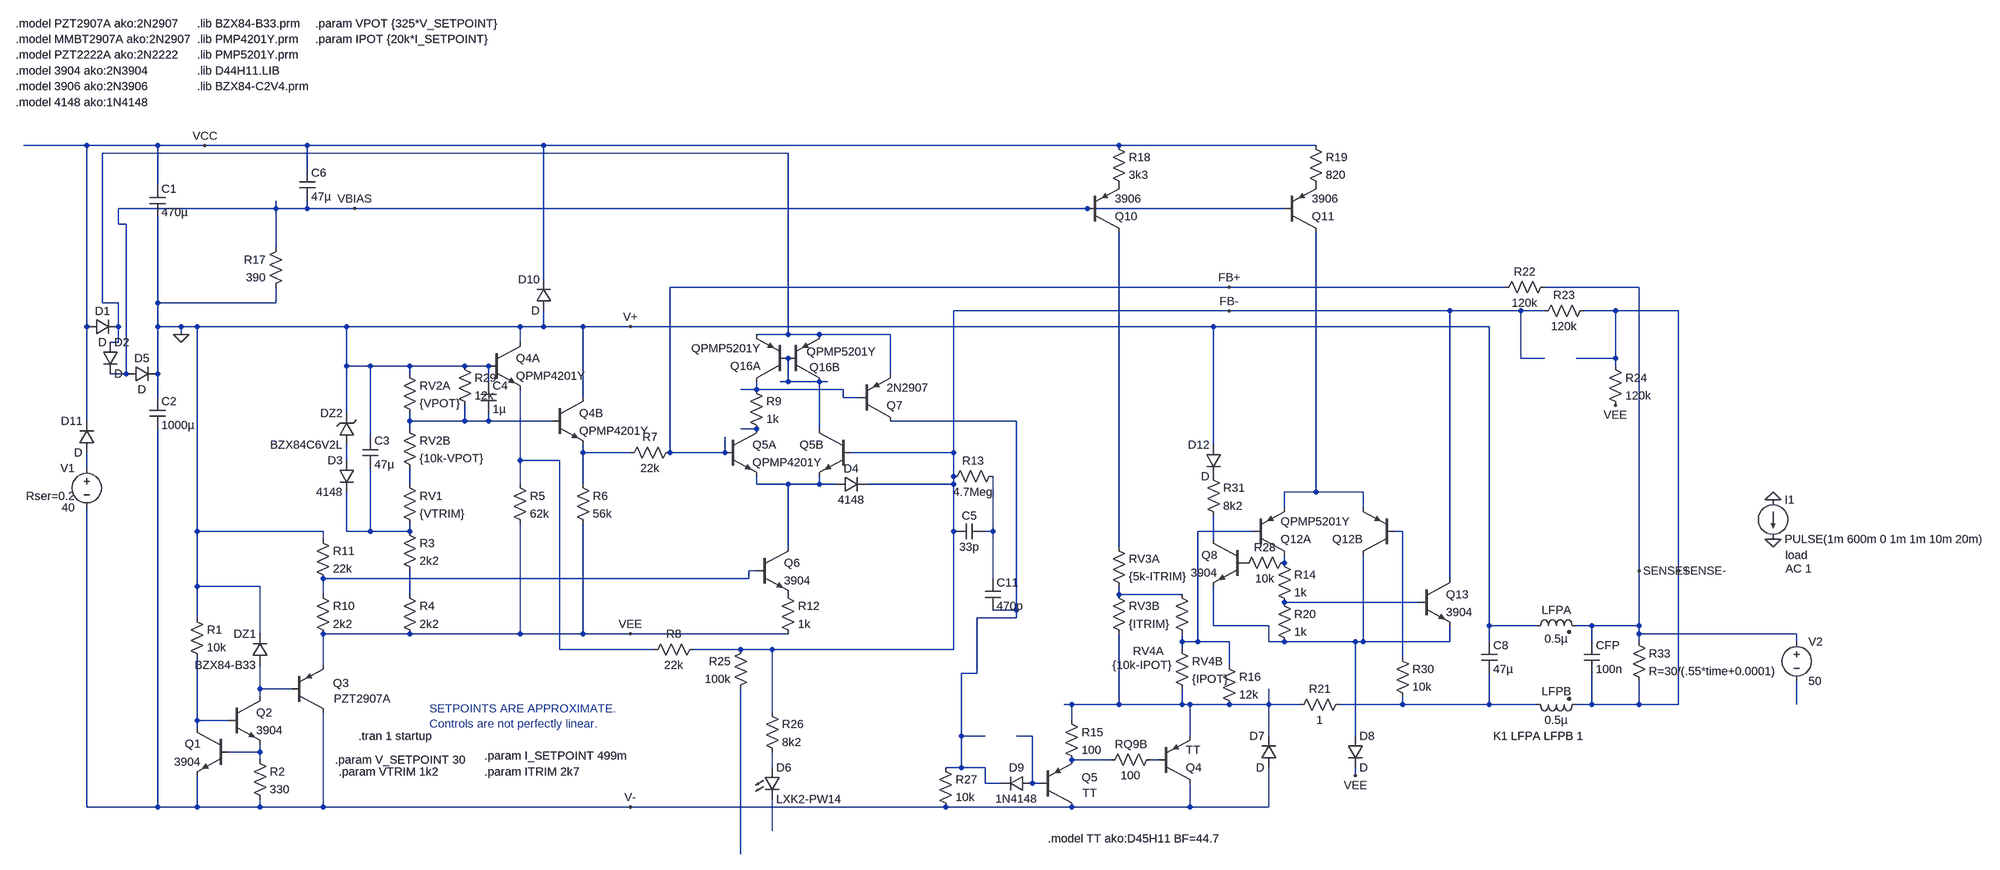
[diagram p0: schematic stability.asc]
stability.asc, the LTspice schematic file:
Version 4
SHEET 1 3448 888
WIRE -464 -800 -592 -800
WIRE -320 -800 -464 -800
WIRE -224 -800 -320 -800
WIRE -16 -800 -224 -800
WIRE 464 -800 -16 -800
WIRE 1632 -800 464 -800
WIRE 2032 -800 1632 -800
WIRE 960 -784 -432 -784
WIRE -16 -752 -16 -800
WIRE -320 -720 -320 -800
WIRE -80 -672 -80 -688
WIRE -80 -672 -400 -672
WIRE -16 -672 -16 -688
WIRE -16 -672 -80 -672
WIRE 80 -672 -16 -672
WIRE 1568 -672 80 -672
WIRE 1968 -672 1568 -672
WIRE -400 -640 -400 -672
WIRE -384 -640 -400 -640
WIRE -80 -592 -80 -672
WIRE 464 -528 464 -800
WIRE 1856 -512 720 -512
WIRE 2416 -512 1856 -512
WIRE 2688 -512 2496 -512
WIRE -432 -480 -432 -784
WIRE -400 -480 -432 -480
WIRE -320 -480 -320 -656
WIRE -80 -480 -80 -512
WIRE -80 -480 -320 -480
WIRE 1856 -464 1296 -464
WIRE 2304 -464 1856 -464
WIRE 2448 -464 2304 -464
WIRE 2496 -464 2448 -464
WIRE 2640 -464 2576 -464
WIRE 2768 -464 2640 -464
WIRE -464 -432 -464 -800
WIRE -400 -432 -400 -480
WIRE -320 -432 -320 -480
WIRE -272 -432 -320 -432
WIRE -240 -432 -272 -432
WIRE 64 -432 -240 -432
WIRE 416 -432 64 -432
WIRE 464 -432 464 -464
WIRE 464 -432 416 -432
WIRE 544 -432 464 -432
WIRE 640 -432 544 -432
WIRE 1824 -432 640 -432
WIRE 2384 -432 1824 -432
WIRE -272 -416 -272 -432
WIRE 960 -416 960 -784
WIRE 960 -416 896 -416
WIRE 1024 -416 960 -416
WIRE 1168 -416 1024 -416
WIRE -400 -400 -400 -432
WIRE -400 -400 -416 -400
WIRE 416 -400 416 -432
WIRE 2448 -368 2448 -464
WIRE 2496 -368 2448 -368
WIRE 2640 -368 2640 -464
WIRE 2640 -368 2560 -368
WIRE 64 -352 64 -432
WIRE 112 -352 64 -352
WIRE 192 -352 112 -352
WIRE 304 -352 192 -352
WIRE 352 -352 304 -352
WIRE 2640 -352 2640 -368
WIRE -384 -336 -384 -640
WIRE -384 -336 -416 -336
WIRE -320 -336 -320 -432
WIRE 192 -336 192 -352
WIRE 1168 -336 1168 -416
WIRE 352 -320 352 -352
WIRE 960 -320 960 -368
WIRE 960 -320 944 -320
WIRE 1024 -320 960 -320
WIRE 1040 -320 1024 -320
WIRE 896 -304 896 -320
WIRE 896 -304 864 -304
WIRE 1072 -304 896 -304
WIRE -320 -288 -320 -336
WIRE 544 -288 544 -432
WIRE 1072 -288 1072 -304
WIRE 1104 -288 1072 -288
WIRE 64 -256 64 -352
WIRE -464 -240 -464 -432
WIRE 192 -240 192 -256
WIRE 304 -240 304 -272
WIRE 304 -240 192 -240
WIRE 352 -240 352 -256
WIRE 352 -240 304 -240
WIRE 480 -240 352 -240
WIRE 1424 -240 1168 -240
WIRE 192 -224 192 -240
WIRE 896 -224 864 -224
WIRE 1024 -224 1024 -320
WIRE 112 -208 112 -352
WIRE 1824 -192 1824 -432
WIRE 544 -176 544 -192
WIRE 640 -176 544 -176
WIRE 720 -176 720 -512
WIRE 832 -176 832 -208
WIRE 832 -176 720 -176
WIRE 1296 -176 1296 -464
WIRE 1296 -176 1088 -176
WIRE 64 -160 64 -192
WIRE 416 -160 416 -304
WIRE 496 -160 416 -160
WIRE -464 -144 -464 -176
WIRE 1296 -128 1296 -176
WIRE 192 -112 192 -144
WIRE 416 -112 416 -160
WIRE 544 -112 544 -176
WIRE 896 -112 896 -128
WIRE 960 -112 896 -112
WIRE 1024 -112 1024 -128
WIRE 1024 -112 960 -112
WIRE 1056 -112 1024 -112
WIRE 1296 -112 1296 -128
WIRE 1296 -112 1120 -112
WIRE 2032 -96 2032 -624
WIRE 2032 -96 1968 -96
WIRE 2128 -96 2032 -96
WIRE 1968 -64 1968 -96
WIRE 2128 -64 2128 -96
WIRE -240 -16 -240 -432
WIRE 16 -16 -240 -16
WIRE 64 -16 64 -96
WIRE 112 -16 112 -144
WIRE 112 -16 64 -16
WIRE 192 -16 192 -32
WIRE 192 -16 112 -16
WIRE 1296 -16 1296 -112
WIRE 1376 -16 1376 -128
WIRE 1376 -16 1360 -16
WIRE 1904 -16 1792 -16
WIRE 2208 -16 2192 -16
WIRE 16 0 16 -16
WIRE 1824 0 1824 -48
WIRE 960 16 960 -112
WIRE 1632 16 1632 -624
WIRE 1968 48 1968 32
WIRE 896 64 880 64
WIRE 2688 64 2688 -512
WIRE 2768 64 2768 -464
WIRE 880 80 880 64
WIRE 880 80 16 80
WIRE 1376 80 1376 -16
WIRE 2304 80 2304 -464
WIRE -240 96 -240 -16
WIRE -112 96 -240 96
WIRE 16 112 16 80
WIRE 192 112 192 64
WIRE 1632 112 1632 96
WIRE 1760 112 1632 112
WIRE 2240 128 1968 128
WIRE 1424 144 1424 -240
WIRE 1424 144 1376 144
WIRE -240 160 -240 96
WIRE 1424 160 1424 144
WIRE 1424 160 1344 160
WIRE 1824 176 1824 96
WIRE 1936 176 1824 176
WIRE 2384 176 2384 -432
WIRE 2480 176 2384 176
WIRE 2592 176 2560 176
WIRE 2688 176 2688 64
WIRE 2688 176 2592 176
WIRE -112 192 -112 96
WIRE 192 192 16 192
WIRE 416 192 416 -32
WIRE 416 192 192 192
WIRE 544 192 544 -32
WIRE 544 192 416 192
WIRE 640 192 544 192
WIRE 960 192 640 192
WIRE 2688 192 2688 176
WIRE 3008 192 2688 192
WIRE 1760 208 1760 192
WIRE 1792 208 1792 -16
WIRE 1792 208 1760 208
WIRE 1856 208 1792 208
WIRE 1936 208 1936 176
WIRE 1968 208 1936 208
WIRE 2112 208 1968 208
WIRE 2128 208 2128 32
WIRE 2128 208 2112 208
WIRE 2304 208 2304 176
WIRE 2304 208 2128 208
WIRE 2384 208 2384 176
WIRE 2592 208 2592 176
WIRE 2688 208 2688 192
WIRE 3008 208 3008 192
WIRE 496 224 496 -160
WIRE 688 224 496 224
WIRE 864 224 768 224
WIRE 928 224 864 224
WIRE 1296 224 1296 -16
WIRE 1296 224 928 224
WIRE 1760 224 1760 208
WIRE 2208 240 2208 -16
WIRE 16 256 16 192
WIRE 1856 256 1856 208
WIRE 1344 272 1344 160
WIRE 1344 272 1312 272
WIRE -112 304 -112 256
WIRE -48 304 -112 304
WIRE -112 320 -112 304
WIRE 1536 336 1520 336
WIRE 1632 336 1632 192
WIRE 1632 336 1536 336
WIRE 1760 336 1760 304
WIRE 1760 336 1632 336
WIRE 1776 336 1760 336
WIRE 1856 336 1776 336
WIRE 1936 336 1936 304
WIRE 1936 336 1856 336
WIRE 2000 336 1936 336
WIRE 2208 336 2208 320
WIRE 2208 336 2080 336
WIRE 2384 336 2384 272
WIRE 2384 336 2208 336
WIRE 2480 336 2384 336
WIRE 2592 336 2592 272
WIRE 2592 336 2560 336
WIRE 2688 336 2688 288
WIRE 2688 336 2592 336
WIRE 2768 336 2768 64
WIRE 2768 336 2688 336
WIRE 3008 336 3008 288
WIRE 928 352 928 224
WIRE -240 368 -240 240
WIRE -176 368 -240 368
WIRE 1536 368 1536 336
WIRE -240 384 -240 368
WIRE 1312 400 1312 272
WIRE 1360 400 1312 400
WIRE 1456 400 1424 400
WIRE 1776 400 1776 336
WIRE 1936 400 1936 336
WIRE 2112 400 2112 208
WIRE -112 432 -112 416
WIRE -112 432 -176 432
WIRE -112 448 -112 432
WIRE 1616 448 1536 448
WIRE 1712 448 1696 448
WIRE 928 464 928 432
WIRE 1312 464 1312 400
WIRE 1312 464 1280 464
WIRE 1360 464 1312 464
WIRE 2112 480 2112 464
WIRE 1360 496 1360 464
WIRE 1392 496 1360 496
WIRE 1456 496 1456 400
WIRE 1472 496 1456 496
WIRE -464 544 -464 -64
WIRE -320 544 -320 -224
WIRE -320 544 -464 544
WIRE -240 544 -240 480
WIRE -240 544 -320 544
WIRE -112 544 -112 528
WIRE -112 544 -240 544
WIRE 16 544 16 352
WIRE 16 544 -112 544
WIRE 640 544 16 544
WIRE 1280 544 640 544
WIRE 1536 544 1280 544
WIRE 1776 544 1776 496
WIRE 1776 544 1536 544
WIRE 1936 544 1936 464
WIRE 1936 544 1776 544
WIRE 928 592 928 528
WIRE 864 640 864 304
FLAG 2640 -272 VEE
FLAG 640 192 VEE
FLAG 640 -432 V+
FLAG 640 544 V-
FLAG 1856 -464 FB-
FLAG 1856 -512 FB+
FLAG -224 -800 VCC
FLAG 80 -672 VBIAS
FLAG 2112 480 VEE
FLAG 2688 64 SENSE+
FLAG 2768 64 SENSE-
FLAG -272 -416 0
FLAG 2960 0 0
FLAG 2960 -80 0
SYMBOL zener 80 -192 R180
WINDOW 0 24 64 Left 2
WINDOW 3 24 0 Left 2
SYMATTR InstName DZ2
SYMATTR Value BZX84C6V2L
SYMATTR Description Diode
SYMATTR Type diode
SYMBOL diode 80 -160 M0
SYMATTR InstName D3
SYMATTR Value 4148
SYMBOL cap 96 -208 R0
SYMATTR InstName C3
SYMATTR Value 47µ
SYMATTR SpiceLine V=10 Rser=7.9
SYMBOL res 176 -352 R0
SYMATTR InstName RV2A
SYMATTR Value {VPOT}
SYMATTR SpiceLine tol=10 pwr=.1
SYMBOL res 176 -240 R0
SYMATTR InstName RV2B
SYMATTR Value {10k-VPOT}
SYMATTR SpiceLine tol=10 pwr=.1
SYMBOL res 176 -128 R0
SYMATTR InstName RV1
SYMATTR Value {VTRIM}
SYMATTR SpiceLine tol=10 pwr=.1
SYMBOL cap 336 -320 R0
SYMATTR InstName C4
SYMATTR Value 1µ
SYMBOL npn 352 -400 R0
SYMATTR InstName Q4A
SYMATTR Value QPMP4201Y
SYMBOL res 400 -128 R0
SYMATTR InstName R5
SYMATTR Value 62k
SYMATTR SpiceLine tol=5 pwr=.25
SYMBOL npn 480 -288 R0
SYMATTR InstName Q4B
SYMATTR Value QPMP4201Y
SYMBOL res 528 -128 R0
SYMATTR InstName R6
SYMATTR Value 56k
SYMATTR SpiceLine tol=5 pwr=.25
SYMBOL res 176 -32 R0
SYMATTR InstName R3
SYMATTR Value 2k2
SYMATTR SpiceLine tol=5 pwr=.125
SYMBOL res 176 96 R0
SYMATTR InstName R4
SYMATTR Value 2k2
SYMATTR SpiceLine tol=5 pwr=.125
SYMBOL pnp -48 352 M180
WINDOW 0 84 60 Left 2
WINDOW 3 86 28 Left 2
SYMATTR InstName Q3
SYMATTR Value PZT2907A
SYMBOL diode -96 256 R180
WINDOW 0 24 64 Left 2
WINDOW 3 24 0 Left 2
SYMATTR InstName DZ1
SYMATTR Value BZX84-B33
SYMBOL npn -176 320 R0
SYMATTR InstName Q2
SYMATTR Value 3904
SYMBOL res -128 432 R0
SYMATTR InstName R2
SYMATTR Value 330
SYMATTR SpiceLine tol=5 pwr=0.125
SYMBOL npn -176 384 M0
SYMATTR InstName Q1
SYMATTR Value 3904
SYMBOL res -256 144 R0
SYMATTR InstName R1
SYMATTR Value 10k
SYMATTR SpiceLine tol=5 pwr=0.125
SYMBOL voltage -464 -160 M0
WINDOW 123 24 44 Left 2
WINDOW 39 24 72 Left 2
SYMATTR SpiceLine Rser=0.2
SYMATTR InstName V1
SYMATTR Value 40
SYMBOL cap -336 -288 R0
SYMATTR InstName C2
SYMATTR Value 1000µ
SYMATTR SpiceLine V=63 Rser=0.13
SYMBOL res 736 -192 R90
WINDOW 0 0 56 VBottom 2
WINDOW 3 32 56 VTop 2
SYMATTR InstName R7
SYMATTR Value 22k
SYMATTR SpiceLine tol=0.5 pwr=0.1
SYMBOL npn 832 -224 R0
SYMATTR InstName Q5A
SYMATTR Value QPMP4201Y
SYMBOL npn 1088 -224 M0
WINDOW 3 56 68 Invisible 2
SYMATTR Value QPMP4201Y
SYMATTR InstName Q5B
SYMBOL npn 896 16 R0
SYMATTR InstName Q6
SYMATTR Value 3904
SYMBOL res 944 96 R0
SYMATTR InstName R12
SYMATTR Value 1k
SYMATTR SpiceLine tol=5 pwr=0.125
SYMBOL res 0 96 R0
SYMATTR InstName R10
SYMATTR Value 2k2
SYMBOL res 0 -16 R0
SYMATTR InstName R11
SYMATTR Value 22k
SYMBOL diode 1056 -96 R270
WINDOW 0 32 32 VTop 2
WINDOW 3 0 32 VBottom 2
SYMATTR InstName D4
SYMATTR Value 4148
SYMBOL pnp 1104 -240 M180
SYMATTR InstName Q7
SYMATTR Value 2N2907
SYMBOL res 1712 432 R90
WINDOW 0 0 56 VBottom 2
WINDOW 3 32 56 VTop 2
SYMATTR InstName RQ9B
SYMATTR Value 100
SYMBOL res 2096 320 R90
WINDOW 0 0 56 VBottom 2
WINDOW 3 32 56 VTop 2
SYMATTR InstName R21
SYMATTR Value 1
SYMATTR SpiceLine tol=1 pwr=0.5
SYMBOL cap 2368 208 R0
SYMATTR InstName C8
SYMATTR Value 47µ
SYMATTR SpiceLine V=50 Rser=2.82
SYMBOL ind2 2464 192 R270
WINDOW 0 32 56 VTop 2
WINDOW 3 5 56 VBottom 2
SYMATTR InstName LFPA
SYMATTR Value 0.5µ
SYMATTR Type ind
SYMATTR SpiceLine Rser=0.1 Rpar=100
SYMBOL ind2 2464 320 M90
WINDOW 0 5 56 VBottom 2
WINDOW 3 32 56 VTop 2
SYMATTR InstName LFPB
SYMATTR Value 0.5µ
SYMATTR Type ind
SYMATTR SpiceLine Rser=0.1 Rpar=100
SYMBOL cap 2576 208 R0
SYMATTR InstName CFP
SYMATTR Value 100n
SYMATTR SpiceLine V=200
SYMBOL res 2592 -480 R90
WINDOW 0 0 56 VBottom 2
WINDOW 3 32 56 VTop 2
SYMATTR InstName R23
SYMATTR Value 120k
SYMATTR SpiceLine tol=0.5 pwr=0.1
SYMBOL res 784 208 R90
WINDOW 0 0 56 VBottom 2
WINDOW 3 32 56 VTop 2
SYMATTR InstName R8
SYMATTR Value 22k
SYMATTR SpiceLine tol=0.5 pwr=0.1
SYMBOL res 2512 -528 R90
WINDOW 0 0 56 VBottom 2
WINDOW 3 32 56 VTop 2
SYMATTR InstName R22
SYMATTR Value 120k
SYMATTR SpiceLine tol=0.5 pwr=0.1
SYMBOL res 2624 -368 R0
SYMATTR InstName R24
SYMATTR Value 120k
SYMBOL cap -336 -720 R0
SYMATTR InstName C1
SYMATTR Value 470µ
SYMATTR SpiceLine V=10 Rser=0.68
SYMBOL res -64 -608 M0
SYMATTR InstName R17
SYMATTR Value 390
SYMATTR SpiceLine tol=5 pwr=.125
SYMBOL cap -32 -752 R0
SYMATTR InstName C6
SYMATTR Value 47µ
SYMATTR SpiceLine V=10 Rser=7.9
SYMBOL pnp 1568 -624 M180
SYMATTR InstName Q10
SYMATTR Value 3906
SYMBOL res 1616 -816 R0
SYMATTR InstName R18
SYMATTR Value 3k3
SYMATTR SpiceLine tol=5 pwr=.125
SYMBOL res 1616 96 R0
SYMATTR InstName RV3B
SYMATTR Value {ITRIM}
SYMBOL res 1616 0 R0
SYMATTR InstName RV3A
SYMATTR Value {5k-ITRIM}
SYMBOL res 1744 96 R0
WINDOW 0 -84 131 Left 2
WINDOW 3 -125 160 Left 2
SYMATTR InstName RV4A
SYMATTR Value {10k-IPOT}
SYMBOL res 1744 208 R0
SYMATTR InstName RV4B
SYMATTR Value {IPOT}
SYMBOL pnp 1904 32 M180
SYMATTR InstName Q12A
SYMATTR Value QPMP5201Y
SYMBOL pnp 2192 32 R180
WINDOW 0 65 32 Left 2
WINDOW 3 84 68 Invisible 2
SYMATTR InstName Q12B
SYMATTR Value QPMP5201Y
SYMBOL res 1952 112 R0
SYMATTR InstName R20
SYMATTR Value 1k
SYMBOL npn 2240 80 R0
SYMATTR InstName Q13
SYMATTR Value 3904
SYMBOL pnp 1968 -624 M180
SYMATTR InstName Q11
SYMATTR Value 3906
SYMBOL res 2016 -816 R0
SYMATTR InstName R19
SYMATTR Value 820
SYMATTR SpiceLine tol=5 pwr=.125
SYMBOL pnp 960 -320 R180
SYMATTR InstName Q16A
SYMATTR Value QPMP5201Y
SYMBOL pnp 960 -320 M180
WINDOW 0 44 29 Left 2
WINDOW 3 38 61 Left 2
SYMATTR InstName Q16B
SYMATTR Value QPMP5201Y
SYMBOL res 288 -368 R0
SYMATTR InstName R29
SYMATTR Value 12k
SYMBOL cap 1360 -32 R90
WINDOW 0 0 32 VBottom 2
WINDOW 3 32 32 VTop 2
SYMATTR InstName C5
SYMATTR Value 33p
SYMBOL pnp 1712 496 M180
SYMATTR InstName Q4
SYMATTR Value TT
SYMBOL pnp 1472 544 M180
WINDOW 0 84 60 Left 2
WINDOW 3 86 28 Left 2
SYMATTR InstName Q5
SYMATTR Value TT
SYMBOL res 1520 352 R0
SYMATTR InstName R15
SYMATTR Value 100
SYMBOL res 880 -320 R0
SYMATTR InstName R9
SYMATTR Value 1k
SYMBOL res 1840 240 R0
SYMATTR InstName R16
SYMATTR Value 12k
SYMBOL diode -464 -416 R270
WINDOW 0 32 32 VTop 2
WINDOW 3 0 32 VBottom 2
SYMATTR InstName D1
SYMBOL diode -432 -400 R0
SYMATTR InstName D2
SYMBOL diode -384 -320 R270
WINDOW 0 32 32 VTop 2
WINDOW 3 0 32 VBottom 2
SYMATTR InstName D5
SYMBOL res 880 208 M0
SYMATTR InstName R25
SYMATTR Value 100k
SYMBOL LED 912 464 R0
SYMATTR InstName D6
SYMATTR Value LXK2-PW14
SYMATTR Description Diode
SYMATTR Type diode
SYMBOL res 912 336 R0
SYMATTR InstName R26
SYMATTR Value 8k2
SYMBOL diode 1952 464 R180
WINDOW 0 24 64 Left 2
WINDOW 3 24 0 Left 2
SYMATTR InstName D7
SYMBOL diode 2096 400 R0
SYMATTR InstName D8
SYMBOL diode 480 -464 R180
WINDOW 0 24 64 Left 2
WINDOW 3 24 0 Left 2
SYMATTR InstName D10
SYMBOL diode -448 -176 R180
WINDOW 0 24 64 Left 2
WINDOW 3 24 0 Left 2
SYMATTR InstName D11
SYMBOL res 1264 448 R0
SYMATTR InstName R27
SYMATTR Value 10k
SYMBOL res 2192 224 R0
SYMATTR InstName R30
SYMATTR Value 10k
SYMBOL cap 1360 80 R0
SYMATTR InstName C11
SYMATTR Value 470p
SYMBOL res 1392 -144 R90
WINDOW 0 0 56 VBottom 2
WINDOW 3 32 56 VTop 2
SYMATTR InstName R13
SYMATTR Value 4.7Meg
SYMBOL load2 2960 -80 R0
WINDOW 123 25 140 Left 2
WINDOW 39 25 112 Left 2
SYMATTR Value2 AC 1
SYMATTR SpiceLine load
SYMATTR InstName I1
SYMATTR Value PULSE(1m 600m 0 1m 1m 10m 20m)
SYMBOL res 2672 192 R0
SYMATTR InstName R33
SYMATTR Value R=30/(.55*time+0.0001)
SYMBOL diode 1456 480 R90
WINDOW 0 0 32 VBottom 2
WINDOW 3 32 32 VTop 2
SYMATTR InstName D9
SYMATTR Value 1N4148
SYMBOL voltage 3008 192 R0
WINDOW 123 0 0 Left 2
WINDOW 39 0 0 Left 2
SYMATTR InstName V2
SYMATTR Value 50
SYMBOL res 1952 32 R0
SYMATTR InstName R14
SYMATTR Value 1k
SYMBOL npn 1888 0 M0
SYMATTR InstName Q8
SYMATTR Value 3904
SYMBOL res 1984 32 R90
WINDOW 0 0 56 VBottom 2
WINDOW 3 32 56 VTop 2
SYMATTR InstName R28
SYMATTR Value 10k
SYMBOL res 1808 -144 R0
SYMATTR InstName R31
SYMATTR Value 8k2
SYMBOL diode 1840 -192 M0
SYMATTR InstName D12
TEXT -608 -1048 Left 2 !.model PZT2907A ako:2N2907
TEXT -608 -952 Left 2 !.model 3904 ako:2N3904
TEXT -608 -920 Left 2 !.model 3906 ako:2N3906
TEXT -240 -1048 Left 2 !.lib BZX84-B33.prm
TEXT -240 -1016 Left 2 !.lib PMP4201Y.prm
TEXT 0 -1048 Left 2 !.param VPOT {325*V_SETPOINT}
TEXT 48 472 Left 2 !.param VTRIM 1k2
TEXT -608 -888 Left 2 !.model 4148 ako:1N4148
TEXT -608 -984 Left 2 !.model PZT2222A ako:2N2222
TEXT -608 -1016 Left 2 !.model MMBT2907A ako:2N2907
TEXT -240 -952 Left 2 !.lib D44H11.LIB
TEXT 2392 400 Left 2 !K1 LFPA LFPB 1
TEXT -240 -984 Left 2 !.lib PMP5201Y.prm
TEXT -240 -920 Left 2 !.lib BZX84-C2V4.prm
TEXT 344 472 Left 2 !.param ITRIM 2k7
TEXT 344 440 Left 2 !.param I_SETPOINT 499m
TEXT 0 -1016 Left 2 !.param IPOT {20k*I_SETPOINT}
TEXT 232 344 Left 2 ;SETPOINTS ARE APPROXIMATE.\nControls are not perfectly linear.
TEXT 1488 608 Left 2 !.model TT ako:D45H11 BF=44.7
TEXT 40 448 Left 2 !.param V_SETPOINT 30
TEXT 88 400 Left 2 !.tran 1 startup

The netlist it stands for:
* stability.asc
DZ2 N008 0 BZX84C6V2L
D3 N008 N014 4148
C3 0 N014 47µ V=10 Rser=7.9
RV2A 0 N004 {VPOT} tol=10 pwr=.1
RV2B N004 N011 {10k-VPOT} tol=10 pwr=.1
RV1 N011 N014 {VTRIM} tol=10 pwr=.1
C4 0 N004 1µ
Q4A 0 0 N009 0 QPMP4201Y
R5 N009 VEE 62k tol=5 pwr=.25
Q4B 0 N004 N007 0 QPMP4201Y
R6 N007 VEE 56k tol=5 pwr=.25
R3 N014 N022 2k2 tol=5 pwr=.125
R4 N022 VEE 2k2 tol=5 pwr=.125
Q3 V- N026 VEE 0 PZT2907A
DZ1 N026 0 BZX84-B33
Q2 N026 N030 N032 0 3904
R2 N032 V- 330 tol=5 pwr=0.125
Q1 N030 N032 V- 0 3904
R1 0 N030 10k tol=5 pwr=0.125
V1 N010 V- 40 Rser=0.2
C2 0 V- 1000µ V=63 Rser=0.13
R7 FB+ N007 22k tol=0.5 pwr=0.1
Q5A N006 FB+ N012 0 QPMP4201Y
Q5B N002 FB- N012 0 QPMP4201Y
Q6 N012 N021 P001 0 3904
R12 P001 VEE 1k tol=5 pwr=0.125
R10 N021 VEE 2k2
R11 0 N021 22k
D4 N012 FB- 4148
Q7 N005 N003 N001 0 2N2907
RQ9B N034 N033 100
R21 N028 N027 1 tol=1 pwr=0.5
C8 0 N028 47µ V=50 Rser=2.82
LFPA 0 SENSE+ 0.5µ Rser=0.1 Rpar=100
LFPB N028 SENSE- 0.5µ Rser=0.1 Rpar=100
CFP SENSE+ SENSE- 100n V=200
R23 SENSE- FB- 120k tol=0.5 pwr=0.1
R8 FB- N009 22k tol=0.5 pwr=0.1
R22 SENSE+ FB+ 120k tol=0.5 pwr=0.1
R24 SENSE- VEE 120k
C1 VCC 0 470µ V=10 Rser=0.68
R17 VBIAS 0 390 tol=5 pwr=.125
C6 VCC VBIAS 47µ V=10 Rser=7.9
Q10 N019 VBIAS P002 0 3906
R18 VCC P002 3k3 tol=5 pwr=.125
RV3B N023 N027 {ITRIM}
RV3A N019 N023 {5k-ITRIM}
RV4A N023 N016 {10k-IPOT}
RV4B N016 N027 {IPOT}
Q12A N020 N016 N013 0 QPMP5201Y
Q12B N025 N017 N013 0 QPMP5201Y
R20 N024 N025 1k
Q13 FB- N024 N025 0 3904
Q11 N013 VBIAS P003 0 3906
R19 VCC P003 820 tol=5 pwr=.125
Q16A N003 N002 N001 0 QPMP5201Y
Q16B N002 N002 N001 0 QPMP5201Y
R29 0 N004 12k
C5 N015 FB- 33p
Q4 V- N034 N027 0 TT
Q5 V- N031 N033 0 TT
R15 N027 N033 100
R9 N003 N006 1k
R16 N016 N027 12k
D1 VCC N001 D
D2 N001 VBIAS D
D5 VBIAS 0 D
R25 FB- N037 100k
D6 N035 N036 LXK2-PW14
R26 FB- N035 8k2
D7 V- N027 D
D8 N025 VEE D
D10 0 VCC D
D11 N010 VCC D
R27 N005 V- 10k
R30 N017 N028 10k
C11 N015 N005 470p
R13 N015 FB- 4.7Meg
I1 0 0 PULSE(1m 600m 0 1m 1m 10m 20m) AC 1 load
R33 SENSE+ SENSE- R=30/(.55*time+0.0001)
D9 N031 N005 1N4148
V2 SENSE+ N029 50
R14 N020 N024 1k
Q8 N018 P004 N025 0 3904
R28 N020 P004 10k
R31 P005 N018 8k2
D12 0 P005 D
.model D D
.lib standard.dio
.model NPN NPN
.model PNP PNP
.lib standard.bjt
.model PZT2907A ako:2N2907
.model 3904 ako:2N3904
.model 3906 ako:2N3906
.lib BZX84-B33.prm
.lib PMP4201Y.prm
.param VPOT {325*V_SETPOINT}
.param VTRIM 1k2
.model 4148 ako:1N4148
.model PZT2222A ako:2N2222
.model MMBT2907A ako:2N2907
.lib D44H11.LIB
K1 LFPA LFPB 1
.lib PMP5201Y.prm
.lib BZX84-C2V4.prm
.param ITRIM 2k7
.param I_SETPOINT 499m
.param IPOT {20k*I_SETPOINT}
* SETPOINTS ARE APPROXIMATE.
* Controls are not perfectly linear.
.model TT ako:D45H11 BF=44.7
.param V_SETPOINT 30
.tran 1 startup
.backanno
.end